# Altium schematic sheet Sheet_1.schdoc
size 288 x 200 mm
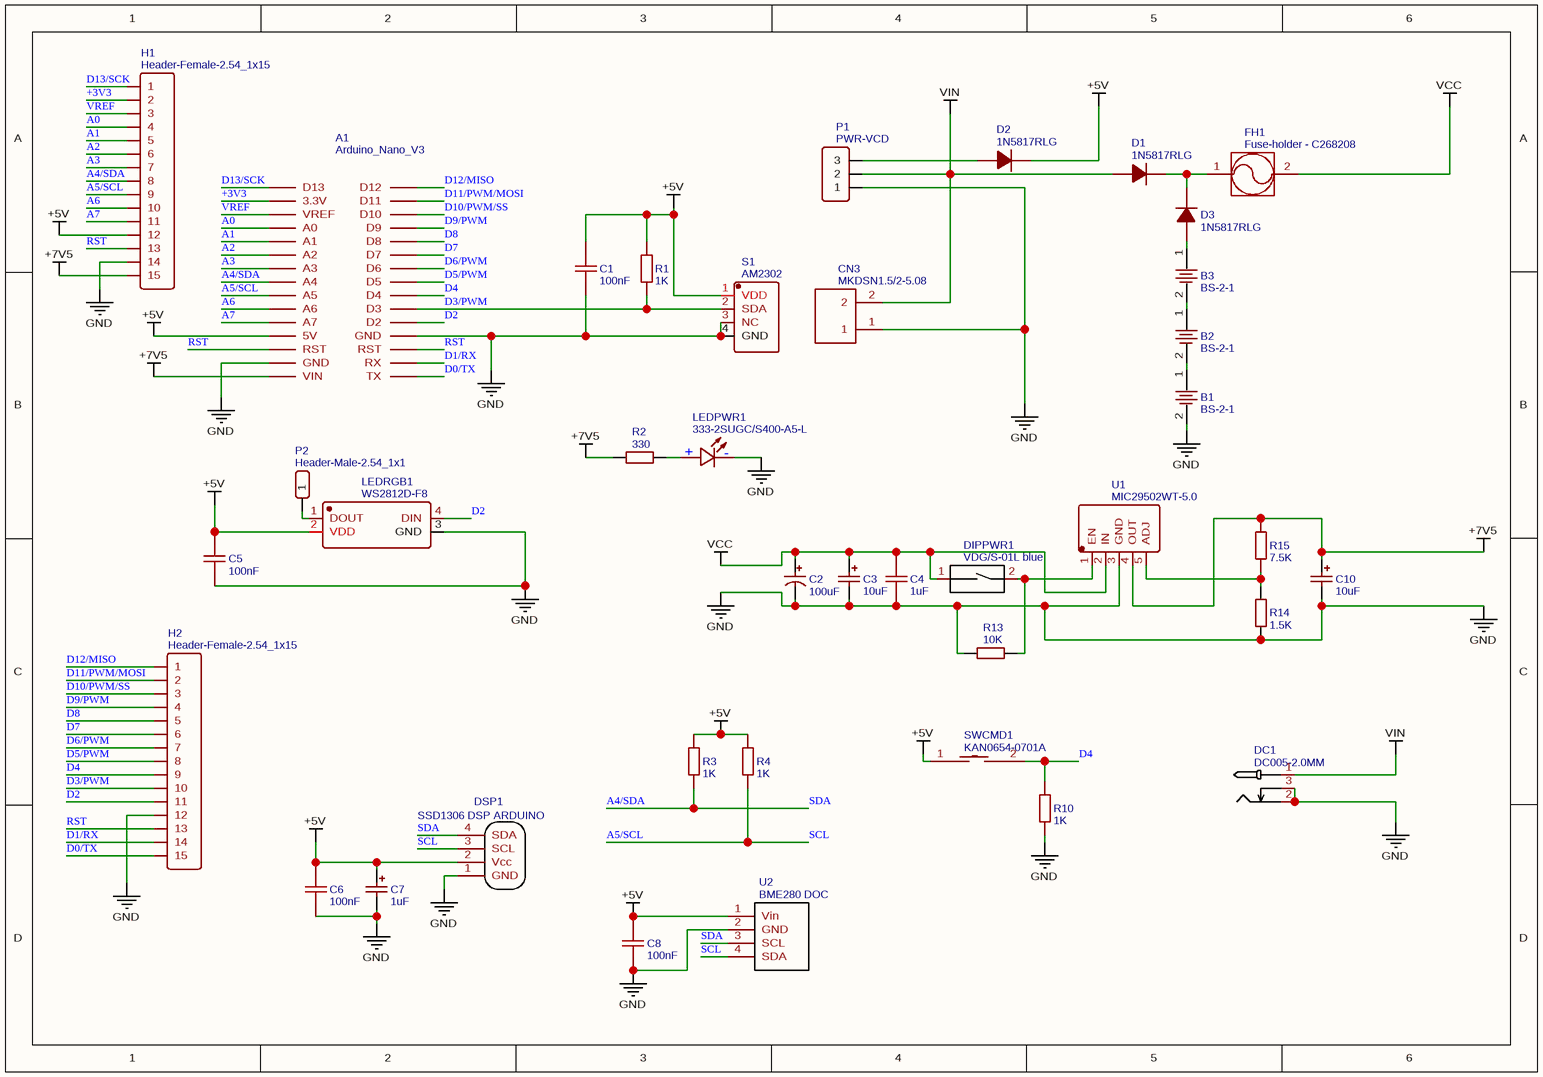
[diagram p0: Sheet_1.schdoc]

## Parts
A1  Arduino_Nano_V3  [ARDUINO_NANO_V3]
B1  BS-2-1  [BATTERY-1]
B2  BS-2-1  [BATTERY-1]
B3  BS-2-1  [BATTERY-1]
C1  100nF  [CAP-CT4-0805-4.2X3.8]
C2  100uF  [CAP-D8.0XF3.5]
C3  10uF  [CAP-TAN-S2.5]
C4  1uF  [CAP-CT4-0805-4.2X3.8]
C5  100nF  [CAP-CT4-0805-4.2X3.8]
C6  100nF  [CAP-CT4-0805-4.2X3.8]
C7  1uF  [CAP-TAN-S2.5]
C8  100nF  [CAP-CT4-0805-4.2X3.8]
C10  10uF  [CAP-TAN-S2.5]
CN3  MKDSN1.5/2-5.08  [MKDSN1.5/2-5.08]
D1  1N5817RLG  [DO-15]
D2  1N5817RLG  [DO-15]
D3  1N5817RLG  [DO-15]
DC1  DC005-2.0MM  [DC-5020]
DIPPWR1  VDG/S-01L blue  [VDG/S-01L]
DSP1  SSD1306 DSP ARDUINO  [SSD1306_ARDUINO]
FH1  Fuse-holder - C268208  [FUSE-HOLDER- C268208]
H1  Header-Female-2.54_1x15  [DIP-1X15P2.54]
H2  Header-Female-2.54_1x15  [DIP-1X15P2.54]
LEDPWR1  333-2SUGC/S400-A5-L  [LED-TH_BD6.2-P2.54-FD]
LEDRGB1  WS2812D-F8  [LED-8.0-RGB4P]
P1  PWR-VCD  [HDR-3X1/2.54]
P2  Header-Male-2.54_1x1  [HDR-1X1/2.54]
R1  1K  [AXIAL-0.4]
R2  330  [AXIAL-0.4]
R3  1K  [AXIAL-0.4]
R4  1K  [AXIAL-0.4]
R10  1K  [AXIAL-0.4]
R13  10K  [AXIAL-0.4]
R14  1.5K  [AXIAL-0.4]
R15  7.5K  [AXIAL-6.3X2.4]
S1  AM2302  [AM2302]
SWCMD1  KAN0654-0701A  [KAN0654-0601B]
U1  MIC29502WT-5.0  [TO-220-5-(10.67X4.83)]
U2  BME280 DOC  [BME280 DOC]

## Nets
+5V: A1.27(5V) C1.1 C5.1 C6.1 C7.1 C8.1 D2.2(C) DSP1.2(Vcc) H1.12 LEDRGB1.2(VDD) R1.2 R3.2 R4.2 S1.1(VDD) SWCMD1.1 U2.1(Vin)
+7V5: A1.30(VIN) C10.1 H1.15 R2.1 R15.2 U1.4(OUT)
GND: A1.4(GND) A1.29(GND) B1.2 C1.2 C2.2 C3.2 C4.2 C5.2 C6.2 C7.2 C8.2 C10.2 CN3.1 DC1.2 DC1.3 DSP1.1(GND) H1.14 H2.12 LEDPWR1.2 LEDRGB1.3(GND) P1.1 R10.1 R13.1 R14.1 S1.3(NC) S1.4(GND) U1.3(GND) U2.2(GND)
VCC: C2.1 C3.1 C4.1 DIPPWR1.1 DIPPWR1.2 FH1.2 R13.2 U1.1(EN) U1.2(IN)
VIN: CN3.2 D1.1(A) DC1.1 P1.2
+3V3: A1.17(3.3V) H1.2
A0: A1.19(A0) H1.4
A1: A1.20(A1) H1.5
A2: A1.21(A2) H1.6
A3: A1.22(A3) H1.7
A4/SDA: A1.23(A4) DSP1.4(SDA) H1.8 R3.1 U2.3(SCL)  [also labelled SDA]
A5/SCL: A1.24(A5) DSP1.3(SCL) H1.9 R4.1 U2.4(SDA)  [also labelled SCL]
A6: A1.25(A6) H1.10
A7: A1.26(A7) H1.11
D0/TX: A1.1(TX) H2.15
D1/RX: A1.2(RX) H2.14
D2: A1.5(D2) H2.11 LEDRGB1.4(DIN)
D3/PWM: A1.6(D3) H2.10 R1.1 S1.2(SDA)
D4: A1.7(D4) H2.9 R10.2 SWCMD1.2
D5/PWM: A1.8(D5) H2.8
D6/PWM: A1.9(D6) H2.7
D7: A1.10(D7) H2.6
D8: A1.11(D8) H2.5
D9/PWM: A1.12(D9) H2.4
D10/PWM/SS: A1.13(D10) H2.3
D11/PWM/MOSI: A1.14(D11) H2.2
D12/MISO: A1.15(D12) H2.1
D13/SCK: A1.16(D13) H1.1
RST: A1.3(RST) A1.28(RST) H1.13 H2.13
VREF: A1.18(VREF) H1.3
NetB1_1: B1.1 B2.2
NetB2_1: B2.1 B3.2
NetB3_1: B3.1 D3.1(A)
NetD1_2: D1.2(C) D3.2(C) FH1.1
NetD2_1: D2.1(A) P1.3
NetLEDPWR1_1: LEDPWR1.1 R2.2
NetLEDRGB1_1: LEDRGB1.1(DOUT) P2.1
NetR14_2: R14.2 R15.1 U1.5(ADJ)

## Notes on the sheet
- (in symbol 333-2SUGC/S400-A5-L) +; -

## Library data of the parts
A1 = Arduino_Nano_V3: BOM_Manufacturer Part: Arduino Nano; Contributor: Coppersillo; spicePre: A
B1-B3 = BS-2-1: BOM_Manufacturer: Q&J; BOM_Supplier: LCSC; BOM_Manufacturer Part: BS-2-1; image: //image.lceda.cn/szlcsc/C70376.jpg; BOM_Supplier Part: C70376; spicePre: B
C1 C5 C6 C8 = 100nF: BOM_Manufacturer: FH; BOM_Manufacturer Part: CT4-0805B104K500F1; nameAlias: Capacitance; Contributor: LCSC; BOM_Supplier: LCSC; BOM_Supplier Part: C168753; spicePre: C; spiceSymbolName: CT4-0805B104K500F1
C2 = 100uF: BOM_Manufacturer: ValuePro; BOM_Manufacturer Part: 50V 100uF 8X12; nameAlias: Capacitance; BOM_Supplier: LCSC; BOM_Supplier Part: C2749; spicePre: C; spiceSymbolName: 50V 100uF 8X12
C3 C10 = 10uF: BOM_Manufacturer: AVX; BOM_Manufacturer Part: TAP106K025SCS; nameAlias: Capacitance; BOM_Supplier: LCSC; BOM_Supplier Part: C28244; spicePre: C; spiceSymbolName: TAP106K025SCS
C4 = 1uF: BOM_Manufacturer: FH; BOM_Manufacturer Part: CT4-0805B105K500F1; nameAlias: Capacitance; Contributor: LCSC; BOM_Supplier: LCSC; BOM_Supplier Part: C169113; spicePre: C; spiceSymbolName: CT4-0805B105K500F1
C7 = 1uF: BOM_Manufacturer: AVX; BOM_Manufacturer Part: TAP105K025SCS; nameAlias: Capacitance; BOM_Supplier: LCSC; BOM_Supplier Part: C49314; spicePre: C; spiceSymbolName: TAP105K025SCS
CN3 = MKDSN1.5/2-5.08: BOM_Manufacturer: Phoenix Contact; BOM_Supplier: LCSC; BOM_Manufacturer Part: MKDSN1.5/2-5.08; BOM_Supplier Part: C91153; spicePre: C
D1-D3 = 1N5817RLG: BOM_Manufacturer: ON Semicon; Contributor: LCSC; BOM_Supplier: LCSC; BOM_Supplier Part: C232461; BOM_Manufacturer Part: 1N5817RLG; spicePre: D
DC1 = DC005-2.0MM: BOM_Manufacturer: SOFNG; BOM_Supplier: LCSC; BOM_Manufacturer Part: DC005-2.0MM; BOM_Supplier Part: C111567; spicePre: D
DIPPWR1 = VDG/S-01L blue: BOM_Manufacturer: ReliaPro; BOM_Supplier: LCSC; BOM_Manufacturer Part: VDG/S-01L blue; image: //image.lceda.cn/szlcsc/C47086.jpg; BOM_Supplier Part: C47086; spicePre: D
DSP1 = SSD1306 DSP ARDUINO: nameAlias: Model; Contributor: MatthiasH; spicePre: X; spiceSymbolName: SSD1306 DSP ARDUINO
FH1 = Fuse-holder - C268208: Contributor: AGRATX; BOM_Supplier: LCSC; spicePre: U
H1 H2 = Header-Female-2.54_1x15: BOM_Manufacturer: Ckmtw; BOM_Manufacturer Part: 220S-1*15P H=8.5MM Ytype Gold-plated; BOM_Supplier: LCSC; BOM_Supplier Part: C124408; spicePre: H
LEDPWR1 = 333-2SUGC/S400-A5-L: BOM_Manufacturer: Everlight Elec; Contributor: LCSC; BOM_Supplier: LCSC; BOM_Supplier Part: C282147; BOM_Manufacturer Part: 333-2SUGC/S400-A5-L; spicePre: L
LEDRGB1 = WS2812D-F8: BOM_Manufacturer: Worldsemi; Contributor: LCSC; BOM_Supplier: LCSC; BOM_Manufacturer Part: WS2812D-F8; BOM_Supplier Part: C139126; spicePre: L
P1 = PWR-VCD: BOM_Manufacturer: BOOMELE; BOM_Manufacturer Part: Header2.54mm 1*3P; BOM_Supplier: LCSC; image: //image.lceda.cn/szlcsc/C49257.jpg; BOM_Supplier Part: C49257; spicePre: P
P2 = Header-Male-2.54_1x1: BOM_Manufacturer: ReliaPro; BOM_Supplier: LCSC; BOM_Manufacturer Part: Header-Male-2.54_1x1; BOM_Supplier Part: C81276; spicePre: P
R1 R3 R4 R10 = 1K: BOM_Manufacturer: Chian Chia Elec; nameAlias: Resistance (Ohms); Contributor: LCSC; BOM_Supplier: LCSC; BOM_Supplier Part: C119324; BOM_Manufacturer Part: -; spicePre: R; spiceSymbolName: MF1/4W-1KΩ±1% T52
R2 = 330: BOM_Manufacturer: UniOhm; BOM_Manufacturer Part: MFR0W4F3300A50; nameAlias: Resistance (Ohms); BOM_Supplier: LCSC; BOM_Supplier Part: C58608; spicePre: R; spiceSymbolName: MFR0W4F3300A50
R13 = 10K: BOM_Manufacturer: UniOhm; BOM_Manufacturer Part: MFR0W4F1002A50; nameAlias: Resistance (Ohms); BOM_Supplier: LCSC; BOM_Supplier Part: C57436; spicePre: R; spiceSymbolName: MFR0W4F1002A50
R14 = 1.5K: BOM_Manufacturer: YAGEO; BOM_Manufacturer Part: MFR-25FTF52-1K5; nameAlias: Resistance (Ohms); BOM_Supplier: LCSC; BOM_Supplier Part: C138204; spicePre: R; spiceSymbolName: MFR-25FTF52-1K5
R15 = 7.5K: BOM_Manufacturer: Futaba Elec; BOM_Manufacturer Part: RNS14F1302A520NH; nameAlias: Resistance (Ohms); Contributor: LCSC; BOM_Supplier: LCSC; BOM_Supplier Part: C274516; spicePre: R; spiceSymbolName: RNS14F1302A520NH
S1 = AM2302: BOM_Manufacturer: AOSONG; BOM_Supplier: LCSC; BOM_Manufacturer Part: AM2302; BOM_Supplier Part: C83988; spicePre: S
SWCMD1 = KAN0654-0701A: BOM_Manufacturer: GANGYUAN; Contributor: LCSC; BOM_Supplier: LCSC; BOM_Supplier Part: C231710; BOM_Manufacturer Part: KAN0654-0701A; spicePre: S
U1 = MIC29502WT-5.0: BOM_Manufacturer: Microchip Tech; BOM_Manufacturer Part: MIC29501-3.3WT; Contributor: LCSC; BOM_Supplier: LCSC; BOM_Supplier Part: C184307; spicePre: U
U2 = BME280 DOC: Contributor: Kuba Jaszczur; spicePre: U